# Altium project Pulse_Sensor_LCD_Microcontroller.PrjPcb
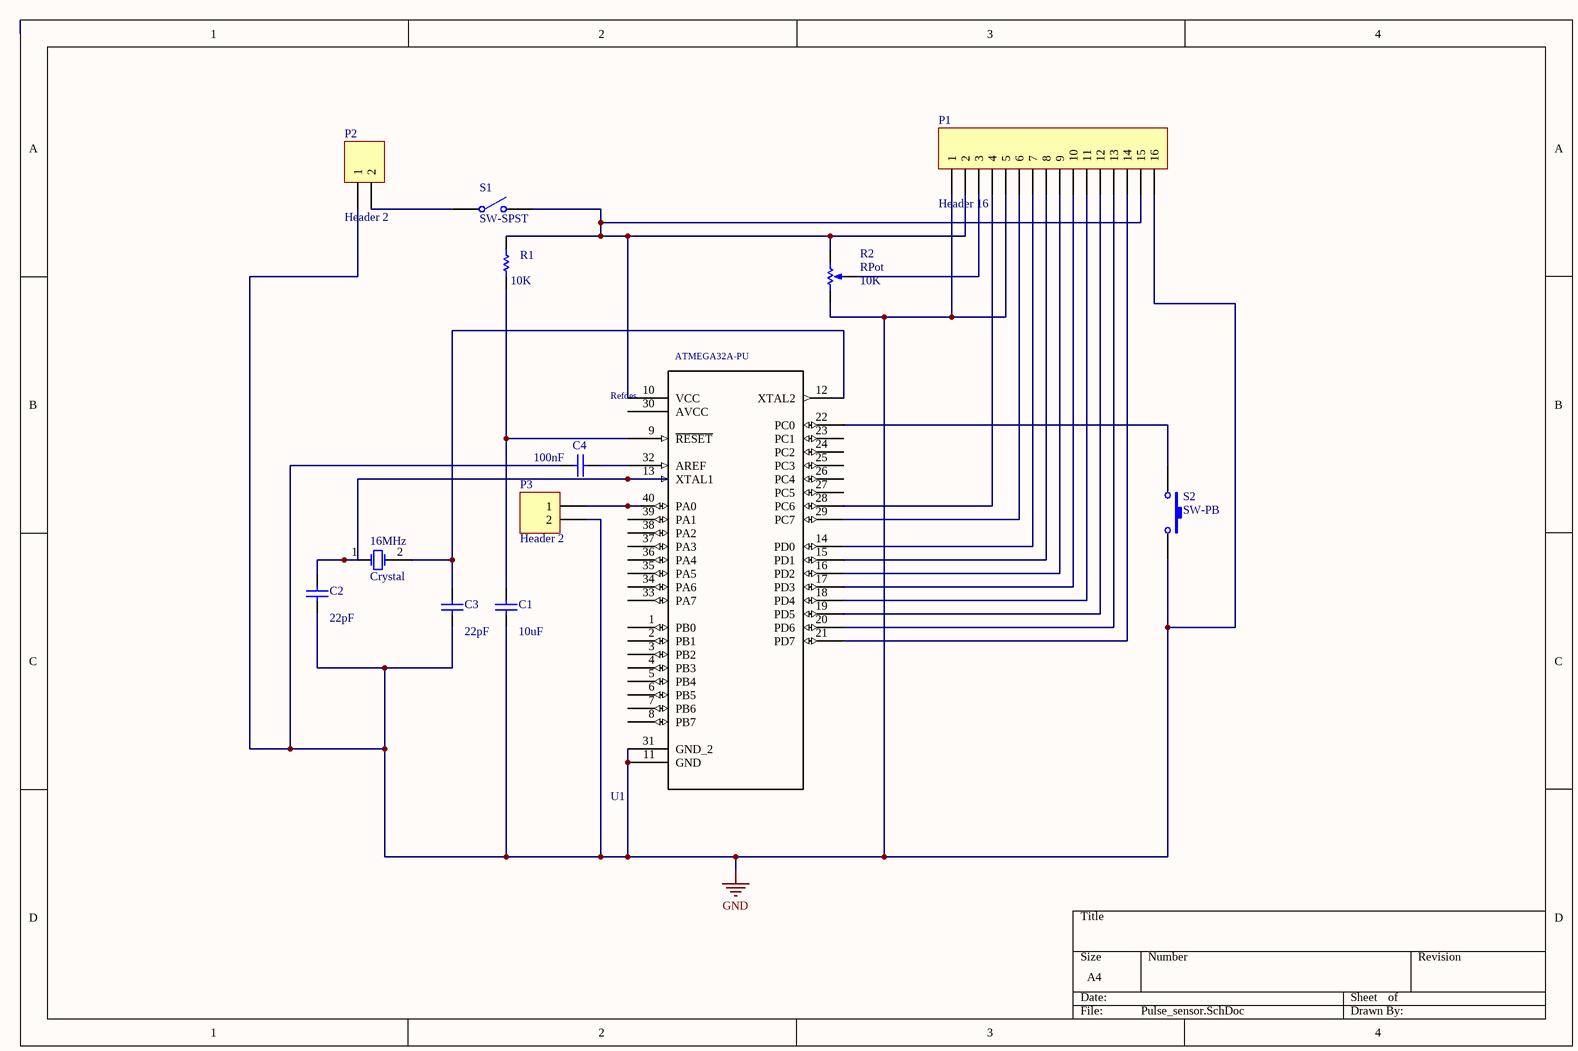
[diagram p0: Pulse_sensor.SchDoc]
1 sheet, 13 parts. Net scope: global (net labels, ports and power ports of the same name join across sheets).
Board file: Pulse_sensor2233.PcbDoc

## Sheet Pulse_sensor.SchDoc
size A4

### Parts
16MHz  Crystal  [R38]
C1  value 10uF  [RAD-0.3]  (hidden comment: Cap)
C2  value 22pF  [RAD-0.3]  (hidden comment: Cap)
C3  value 22pF  [RAD-0.3]  (hidden comment: Cap)
C4  value 100nF  [RAD-0.3]  (hidden comment: Cap)
P1  Header 16  [HDR1X16]
P2  Header 2  [HDR1X2]
P3  Header 2  [HDR1X2]
R1  value 10K  [AXIAL-0.3]  (hidden comment: Res1)
R2  RPot  value 10K  [VR5]
S1  SW-SPST  [SPST-2]
S2  SW-PB  [SPST-2]
U1  ATMEGA32A-PU  [DIP254P1524X482-40]  (value not drawn)

### Nets
GND: C1.1 C2.1 C3.1 C4.1 P1.1 P1.5 P1.16 P2.1 P3.2 R2.1(TOP) S2.2 U1.11(GND) U1.31(GND_2)
Net16MHz_1: 16MHz.1(OSC1) C2.2 U1.13(XTAL1)
Net16MHz_2: 16MHz.2(OSC2) C3.2 U1.12(XTAL2)
NetC1_2: C1.2 R1.1 U1.9(~{RESET})
NetC4_2: C4.2 U1.32(AREF)
NetP1_2: P1.2 P1.15 R1.2 R2.2(BOT) S1.2(NO) U1.10(VCC)
NetP1_3: P1.3 R2.3(TAP)
NetP1_4: P1.4 U1.28(PC6)
NetP1_6: P1.6 U1.29(PC7)
NetP1_7: P1.7 U1.14(PD0)
NetP1_8: P1.8 U1.15(PD1)
NetP1_9: P1.9 U1.16(PD2)
NetP1_10: P1.10 U1.17(PD3)
NetP1_11: P1.11 U1.18(PD4)
NetP1_12: P1.12 U1.19(PD5)
NetP1_13: P1.13 U1.20(PD6)
NetP1_14: P1.14 U1.21(PD7)
NetP2_2: P2.2 S1.1(COMMON)
NetP3_1: P3.1 U1.40(PA0)
NetS2_1: S2.1 U1.22(PC0)

Not connected (* = marked no-connect by the designer): U1 1(PB0) 2(PB1) 3(PB2) 4(PB3) 5(PB4) 6(PB5) 7(PB6) 8(PB7) 23(PC1) 24(PC2) 25(PC3) 26(PC4) 27(PC5) 30(AVCC) 33(PA7) 34(PA6) 35(PA5) 36(PA4) 37(PA3) 38(PA2) 39(PA1)

### Notes on the sheet
- (in symbol ATMEGA32A-PU) Refdes

### Library data of the parts
16MHz = XTAL: Crystal Oscillator; Published: 8-Jun-2000; LatestRevisionDate: 17-Jul-2002; LatestRevisionNote: Re-released for DXP Platform.; PackageReference: R38; Publisher: Altium Limited; PackageDescription: Crystal, Thru-Hole; 2 Leads; Body 3.1 x 8.2 mm (Dia.xH)
C1-C4 = Cap: Capacitor; Published: 8-Jun-2000; LatestRevisionDate: 17-Jul-2002; LatestRevisionNote: Re-released for DXP Platform.; PackageReference: RAD-0.3; Publisher: Altium Limited; PackageDescription: Radial Cap, Thru-Hole; 2 Leads; 0.3 in Pin Spacing
P1 = Header 16: Header, 16-Pin; LatestRevisionDate: 17-Jul-2002; LatestRevisionNote: Re-released for DXP Platform.; Publisher: Altium Limited
P2 P3 = Header 2: Header, 2-Pin; LatestRevisionDate: 17-Jul-2002; LatestRevisionNote: Re-released for DXP Platform.; Publisher: Altium Limited
R1 = Res1: Resistor; Published: 8-Jun-2000; LatestRevisionDate: 17-Jul-2002; LatestRevisionNote: Re-released for DXP Platform.; PackageReference: AXIAL-0.3; Publisher: Altium Limited; PackageDescription: Axial Device, Thru-Hole; 2 Leads; 0.3 in Pin Spacing
R2 = RPot: Potentiometer; Sim Note: Enter the Resistance value and the set point into parameter fields.; Set Position: 0.5; Published: 8-Jun-2000; LatestRevisionDate: 17-Jul-2002; LatestRevisionNote: Re-released for DXP Platform.; PackageReference: VR5; Publisher: Altium Limited; PackageDescription: Variable Resistor, Thru-Hole; 3 Leads
S1 = SW-SPST: Single-Pole, Single-Throw Switch; Published: 24-Mar-1999; LatestRevisionDate: 17-Jul-2002; LatestRevisionNote: Re-released for DXP Platform.; PackageReference: SPST-2; Publisher: Altium Limited; PackageDescription: Switch; 2 Leads
S2 = SW-PB: Switch; Published: 24-Mar-1999; LatestRevisionDate: 17-Jul-2002; LatestRevisionNote: Re-released for DXP Platform.; PackageReference: SPST-2; Publisher: Altium Limited; PackageDescription: Switch; 2 Leads
U1 = ATMEGA32A-PU: ATmega Series 16 MHz 32 KB Flash 2 KB SRAM 8-Bit Microcontroller - DIP-40_Ã‘Ã’; MF: Microchip; Availability: Unavailable; Price: None; SnapEDA_Link: https://www.snapeda.com/parts/ATMEGA32A-PU/Microchip/view-part/?ref=snap; MP: ATMEGA32A-PU; Package: PDIP-40 Microchip; Value: *